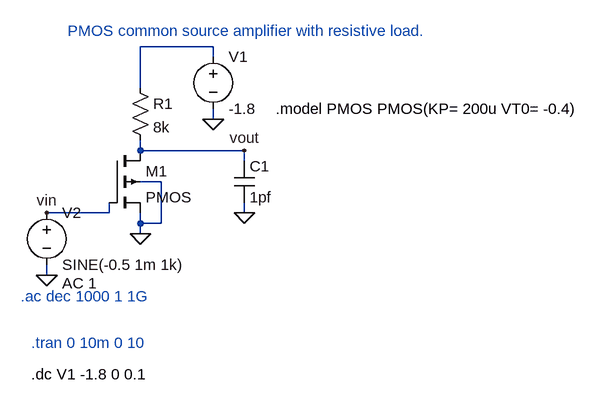
[diagram p0: schematic PMOS_common_source_amp_res_load.asc]
PMOS_common_source_amp_res_load.asc, the LTspice schematic file:
Version 4
SHEET 1 888 680
WIRE 304 -48 192 -48
WIRE 304 -32 304 -48
WIRE 192 16 192 -48
WIRE 304 64 304 48
WIRE 192 112 192 96
WIRE 352 112 192 112
WIRE 352 128 352 112
WIRE 224 160 192 160
WIRE 144 208 144 192
WIRE 144 208 48 208
WIRE 352 208 352 192
WIRE 192 224 192 208
WIRE 224 224 224 160
WIRE 224 224 192 224
WIRE 192 240 192 224
WIRE 48 304 48 288
FLAG 304 64 0
FLAG 192 240 0
FLAG 48 304 0
FLAG 352 208 0
FLAG 352 112 vout
FLAG 48 208 vin
SYMBOL pmos4 144 112 R0
SYMATTR InstName M1
SYMATTR Value2 l=1u w=144u
SYMBOL res 176 0 R0
SYMATTR InstName R1
SYMATTR Value 8k
SYMBOL voltage 304 -48 R0
WINDOW 123 0 0 Left 0
WINDOW 39 0 0 Left 0
SYMATTR InstName V1
SYMATTR Value -1.8
SYMBOL voltage 48 192 R0
WINDOW 123 24 124 Left 2
WINDOW 39 0 0 Left 0
SYMATTR InstName V2
SYMATTR Value SINE(-0.5 1m 1k)
SYMATTR Value2 AC 1
SYMBOL cap 336 128 R0
SYMATTR InstName C1
SYMATTR Value 1pf
TEXT 400 48 Left 2 !.model PMOS PMOS(KP= 200u VT0= -0.4)
TEXT 8 336 Left 2 ;.ac dec 1000 1 1G
TEXT 80 -72 Left 2 ;PMOS common source amplifier with resistive load.
TEXT 24 408 Left 2 ;.tran 0 10m 0 10
TEXT 24 456 Left 2 !.dc V1 -1.8 0 0.1

The netlist it stands for:
* PMOS_common_source_amp_res_load.asc
M1 vout vin 0 0 PMOS l=1u w=144u
R1 N001 vout 8k
V1 N001 0 -1.8
V2 vin 0 SINE(-0.5 1m 1k) AC 1
C1 vout 0 1pf
.model NMOS NMOS
.model PMOS PMOS
.lib standard.mos
.model PMOS PMOS(KP= 200u VT0= -0.4)
* .ac dec 1000 1 1G
* PMOS common source amplifier with resistive load.
* .tran 0 10m 0 10
.dc V1 -1.8 0 0.1
.backanno
.end